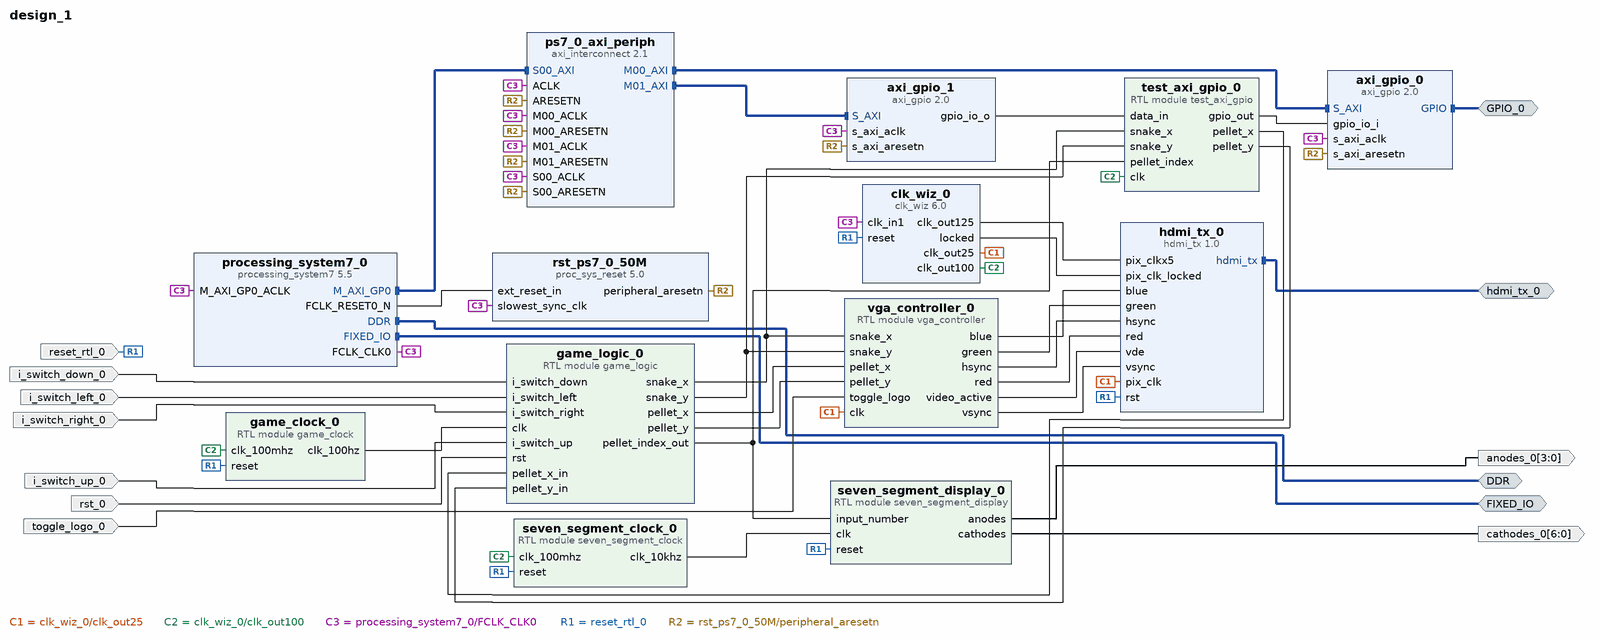
[diagram p0: block diagram of the top level]
# Vivado block design design_1, xc7z007sclg400-1, Vivado 2023.1
create_bd_design design_1

create_bd_intf_port -mode Master -vlnv xilinx.com:interface:ddrx_rtl:1.0 DDR
create_bd_intf_port -mode Master -vlnv xilinx.com:display_processing_system7:fixedio_rtl:1.0 FIXED_IO
create_bd_intf_port -mode Master -vlnv xilinx.com:interface:hdmi_rtl:2.0 hdmi_tx_0
create_bd_intf_port -mode Master -vlnv xilinx.com:interface:gpio_rtl:1.0 GPIO_0
create_bd_port -dir I -type rst reset_rtl_0
set_property -dict {CONFIG.POLARITY ACTIVE_HIGH} [get_bd_ports reset_rtl_0]
create_bd_port -dir I i_switch_up_0
create_bd_port -dir I i_switch_down_0
create_bd_port -dir I i_switch_left_0
create_bd_port -dir I i_switch_right_0
create_bd_port -dir O -from 6 -to 0 cathodes_0
create_bd_port -dir O -from 3 -to 0 anodes_0
create_bd_port -dir I -type rst rst_0
set_property -dict {CONFIG.POLARITY ACTIVE_HIGH} [get_bd_ports rst_0]
create_bd_port -dir I toggle_logo_0

create_bd_cell -type ip -vlnv xilinx.com:ip:processing_system7:5.5 processing_system7_0
set_property -dict [list \
  CONFIG.PCW_FPGA0_PERIPHERAL_FREQMHZ 50 \
  CONFIG.PCW_GPIO_MIO_GPIO_ENABLE 1 \
  CONFIG.PCW_GPIO_MIO_GPIO_IO MIO \
  CONFIG.PCW_I2C_RESET_ENABLE 1 \
  CONFIG.PCW_QSPI_GRP_FBCLK_ENABLE 1 \
  CONFIG.PCW_QSPI_GRP_FBCLK_IO {MIO 8} \
  CONFIG.PCW_QSPI_GRP_SINGLE_SS_ENABLE 1 \
  CONFIG.PCW_QSPI_GRP_SINGLE_SS_IO {MIO 1 .. 6} \
  CONFIG.PCW_QSPI_PERIPHERAL_ENABLE 1 \
  CONFIG.PCW_QSPI_QSPI_IO {MIO 1 .. 6} \
  CONFIG.PCW_SD0_GRP_CD_ENABLE 1 \
  CONFIG.PCW_SD0_GRP_CD_IO {MIO 47} \
  CONFIG.PCW_SD0_GRP_WP_ENABLE 0 \
  CONFIG.PCW_SD0_PERIPHERAL_ENABLE 1 \
  CONFIG.PCW_SD0_SD0_IO {MIO 40 .. 45} \
  CONFIG.PCW_SDIO_PERIPHERAL_FREQMHZ 100 \
  CONFIG.PCW_SINGLE_QSPI_DATA_MODE x4 \
  CONFIG.PCW_SPI1_PERIPHERAL_ENABLE 1 \
  CONFIG.PCW_SPI1_SPI1_IO {MIO 10 .. 15} \
  CONFIG.PCW_UART1_PERIPHERAL_ENABLE 1 \
  CONFIG.PCW_UART1_UART1_IO {MIO 48 .. 49} \
  CONFIG.PCW_UART_PERIPHERAL_FREQMHZ 100 \
  CONFIG.PCW_UIPARAM_DDR_BUS_WIDTH {16 Bit} \
  CONFIG.PCW_UIPARAM_DDR_MEMORY_TYPE {DDR 3 (Low Voltage)} \
  CONFIG.PCW_UIPARAM_DDR_PARTNO Custom \
  CONFIG.PCW_USB0_PERIPHERAL_ENABLE 1 \
  CONFIG.PCW_USB0_RESET_ENABLE 1 \
  CONFIG.PCW_USB0_RESET_IO {MIO 46} \
  CONFIG.PCW_USB0_USB0_IO {MIO 28 .. 39} \
  CONFIG.PCW_USB_RESET_ENABLE 1 \
  CONFIG.PCW_USB_RESET_SELECT {Share reset pin} \
] [get_bd_cells processing_system7_0]
# 224 more settings of processing_system7_0 are not shown: defaults, MIO pin electricals, DDR timing, and values the tool derives
create_bd_cell -type ip -vlnv realdigital.org:realdigital:hdmi_tx:1.0 hdmi_tx_0
create_bd_cell -type ip -vlnv xilinx.com:ip:clk_wiz:6.0 clk_wiz_0
set_property -dict [list \
  CONFIG.CLKOUT1_JITTER 236.428 \
  CONFIG.CLKOUT1_REQUESTED_OUT_FREQ 25.000 \
  CONFIG.CLKOUT2_JITTER 154.207 \
  CONFIG.CLKOUT2_PHASE_ERROR 164.985 \
  CONFIG.CLKOUT2_REQUESTED_OUT_FREQ 125.000 \
  CONFIG.CLKOUT2_USED true \
  CONFIG.CLKOUT3_JITTER 162.035 \
  CONFIG.CLKOUT3_PHASE_ERROR 164.985 \
  CONFIG.CLKOUT3_USED true \
  CONFIG.CLK_OUT1_PORT clk_out25 \
  CONFIG.CLK_OUT2_PORT clk_out125 \
  CONFIG.CLK_OUT3_PORT clk_out100 \
  CONFIG.MMCM_CLKOUT0_DIVIDE_F 40.000 \
  CONFIG.MMCM_CLKOUT1_DIVIDE 8 \
  CONFIG.MMCM_CLKOUT2_DIVIDE 10 \
  CONFIG.NUM_OUT_CLKS 3 \
] [get_bd_cells clk_wiz_0]
create_bd_cell -type ip -vlnv xilinx.com:ip:axi_gpio:2.0 axi_gpio_0
set_property -dict {CONFIG.C_ALL_INPUTS 1 CONFIG.C_IS_DUAL 0} [get_bd_cells axi_gpio_0]
create_bd_cell -type ip -vlnv xilinx.com:ip:axi_interconnect:2.1 ps7_0_axi_periph
set_property -dict {CONFIG.NUM_MI 2} [get_bd_cells ps7_0_axi_periph]
create_bd_cell -type ip -vlnv xilinx.com:ip:proc_sys_reset:5.0 rst_ps7_0_50M
create_bd_cell -type module -reference seven_segment_clock seven_segment_clock_0
create_bd_cell -type module -reference test_axi_gpio test_axi_gpio_0
create_bd_cell -type ip -vlnv xilinx.com:ip:axi_gpio:2.0 axi_gpio_1
set_property -dict {CONFIG.C_ALL_OUTPUTS 1} [get_bd_cells axi_gpio_1]
create_bd_cell -type module -reference seven_segment_display seven_segment_display_0
create_bd_cell -type module -reference game_logic game_logic_0
create_bd_cell -type module -reference game_clock game_clock_0
create_bd_cell -type module -reference vga_controller vga_controller_0

# ---- connections ----

connect_bd_intf_net [get_bd_intf_ports GPIO_0] [get_bd_intf_pins axi_gpio_0/GPIO]
connect_bd_intf_net [get_bd_intf_ports hdmi_tx_0] [get_bd_intf_pins hdmi_tx_0/hdmi_tx]
connect_bd_intf_net [get_bd_intf_ports DDR] [get_bd_intf_pins processing_system7_0/DDR]
connect_bd_intf_net [get_bd_intf_ports FIXED_IO] [get_bd_intf_pins processing_system7_0/FIXED_IO]
connect_bd_intf_net [get_bd_intf_pins processing_system7_0/M_AXI_GP0] [get_bd_intf_pins ps7_0_axi_periph/S00_AXI]
connect_bd_intf_net [get_bd_intf_pins ps7_0_axi_periph/M00_AXI] [get_bd_intf_pins axi_gpio_0/S_AXI]
connect_bd_intf_net [get_bd_intf_pins ps7_0_axi_periph/M01_AXI] [get_bd_intf_pins axi_gpio_1/S_AXI]
connect_bd_net [get_bd_pins axi_gpio_1/gpio_io_o] [get_bd_pins test_axi_gpio_0/data_in]
connect_bd_net [get_bd_pins clk_wiz_0/clk_out25] [get_bd_pins hdmi_tx_0/pix_clk] [get_bd_pins vga_controller_0/clk]
connect_bd_net [get_bd_pins clk_wiz_0/clk_out100] \
  [get_bd_pins seven_segment_clock_0/clk_100mhz] [get_bd_pins test_axi_gpio_0/clk] [get_bd_pins game_clock_0/clk_100mhz]
connect_bd_net [get_bd_pins clk_wiz_0/clk_out125] [get_bd_pins hdmi_tx_0/pix_clkx5]
connect_bd_net [get_bd_pins clk_wiz_0/locked] [get_bd_pins hdmi_tx_0/pix_clk_locked]
connect_bd_net -net game_clock_0_clk_10hz [get_bd_pins game_clock_0/clk_100hz] [get_bd_pins game_logic_0/clk]
connect_bd_net [get_bd_pins game_logic_0/pellet_index_out] \
  [get_bd_pins test_axi_gpio_0/pellet_index] [get_bd_pins seven_segment_display_0/input_number]
connect_bd_net [get_bd_pins game_logic_0/pellet_x] [get_bd_pins vga_controller_0/pellet_x]
connect_bd_net [get_bd_pins game_logic_0/pellet_y] [get_bd_pins vga_controller_0/pellet_y]
connect_bd_net [get_bd_pins game_logic_0/snake_x] [get_bd_pins test_axi_gpio_0/snake_x] [get_bd_pins vga_controller_0/snake_x]
connect_bd_net [get_bd_pins game_logic_0/snake_y] [get_bd_pins test_axi_gpio_0/snake_y] [get_bd_pins vga_controller_0/snake_y]
connect_bd_net -net i_switch_down_0_1 [get_bd_ports i_switch_down_0] [get_bd_pins game_logic_0/i_switch_down]
connect_bd_net -net i_switch_left_0_1 [get_bd_ports i_switch_left_0] [get_bd_pins game_logic_0/i_switch_left]
connect_bd_net -net i_switch_right_0_1 [get_bd_ports i_switch_right_0] [get_bd_pins game_logic_0/i_switch_right]
connect_bd_net -net i_switch_up_0_1 [get_bd_ports i_switch_up_0] [get_bd_pins game_logic_0/i_switch_up]
connect_bd_net [get_bd_pins processing_system7_0/FCLK_CLK0] \
  [get_bd_pins processing_system7_0/M_AXI_GP0_ACLK] [get_bd_pins clk_wiz_0/clk_in1] [get_bd_pins ps7_0_axi_periph/S00_ACLK] \
  [get_bd_pins rst_ps7_0_50M/slowest_sync_clk] [get_bd_pins axi_gpio_0/s_axi_aclk] [get_bd_pins ps7_0_axi_periph/M00_ACLK] \
  [get_bd_pins ps7_0_axi_periph/ACLK] [get_bd_pins ps7_0_axi_periph/M01_ACLK] [get_bd_pins axi_gpio_1/s_axi_aclk]
connect_bd_net [get_bd_pins processing_system7_0/FCLK_RESET0_N] [get_bd_pins rst_ps7_0_50M/ext_reset_in]
connect_bd_net -net reset_rtl_0_1 [get_bd_ports reset_rtl_0] \
  [get_bd_pins hdmi_tx_0/rst] [get_bd_pins clk_wiz_0/reset] [get_bd_pins seven_segment_clock_0/reset] \
  [get_bd_pins seven_segment_display_0/reset] [get_bd_pins game_clock_0/reset]
connect_bd_net -net rst_0_1 [get_bd_ports rst_0] [get_bd_pins game_logic_0/rst]
connect_bd_net [get_bd_pins rst_ps7_0_50M/peripheral_aresetn] \
  [get_bd_pins ps7_0_axi_periph/S00_ARESETN] [get_bd_pins axi_gpio_0/s_axi_aresetn] \
  [get_bd_pins ps7_0_axi_periph/M00_ARESETN] [get_bd_pins ps7_0_axi_periph/ARESETN] \
  [get_bd_pins ps7_0_axi_periph/M01_ARESETN] [get_bd_pins axi_gpio_1/s_axi_aresetn]
connect_bd_net [get_bd_pins seven_segment_clock_0/clk_10khz] [get_bd_pins seven_segment_display_0/clk]
connect_bd_net [get_bd_pins seven_segment_display_0/anodes] [get_bd_ports anodes_0]
connect_bd_net [get_bd_pins seven_segment_display_0/cathodes] [get_bd_ports cathodes_0]
connect_bd_net [get_bd_pins test_axi_gpio_0/gpio_out] [get_bd_pins axi_gpio_0/gpio_io_i]
connect_bd_net [get_bd_pins test_axi_gpio_0/pellet_x] [get_bd_pins game_logic_0/pellet_x_in]
connect_bd_net [get_bd_pins test_axi_gpio_0/pellet_y] [get_bd_pins game_logic_0/pellet_y_in]
connect_bd_net -net toggle_logo_0_1 [get_bd_ports toggle_logo_0] [get_bd_pins vga_controller_0/toggle_logo]
connect_bd_net [get_bd_pins vga_controller_0/blue] [get_bd_pins hdmi_tx_0/blue]
connect_bd_net [get_bd_pins vga_controller_0/green] [get_bd_pins hdmi_tx_0/green]
connect_bd_net [get_bd_pins vga_controller_0/hsync] [get_bd_pins hdmi_tx_0/hsync]
connect_bd_net [get_bd_pins vga_controller_0/red] [get_bd_pins hdmi_tx_0/red]
connect_bd_net [get_bd_pins vga_controller_0/video_active] [get_bd_pins hdmi_tx_0/vde]
connect_bd_net [get_bd_pins vga_controller_0/vsync] [get_bd_pins hdmi_tx_0/vsync]
set_property HDL_ATTRIBUTE.BMM_INFO_PROCESSOR {arm > design_1 axi_bram_ctrl_0} [get_bd_cells processing_system7_0]
set_property HDL_ATTRIBUTE.KEEP_HIERARCHY yes [get_bd_cells processing_system7_0]

# ---- address map ----
assign_bd_address -offset 0x41200000 -range 64K -target_address_space [get_bd_addr_spaces processing_system7_0/Data] [get_bd_addr_segs axi_gpio_0/S_AXI/Reg]
assign_bd_address -offset 0x41210000 -range 64K -target_address_space [get_bd_addr_spaces processing_system7_0/Data] [get_bd_addr_segs axi_gpio_1/S_AXI/Reg]

validate_bd_design
save_bd_design
